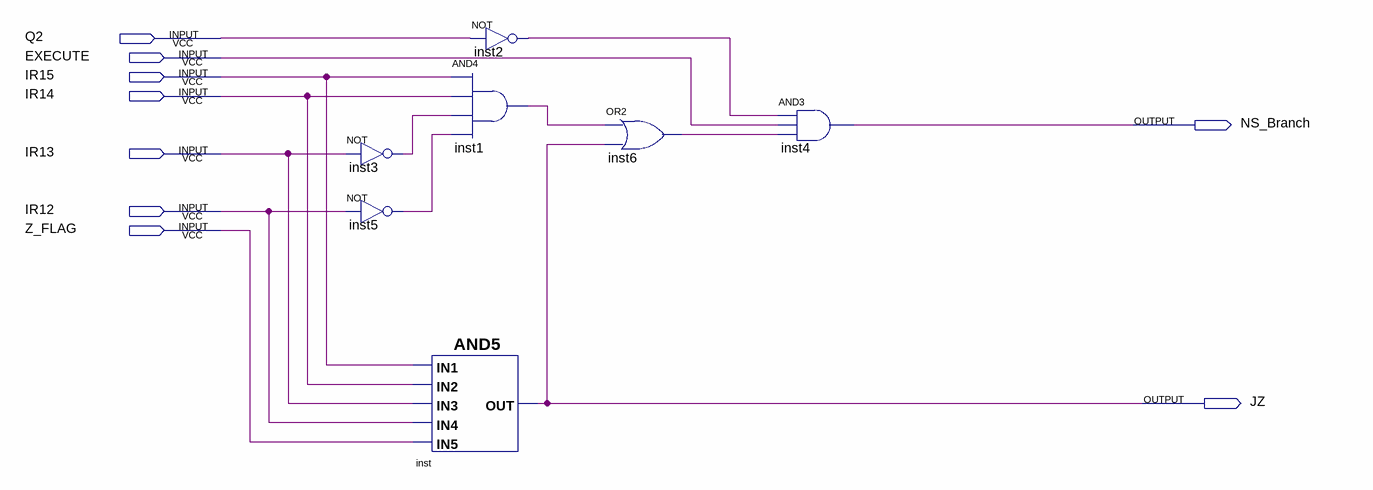
[diagram p0: schematic sheet]
// Quartus schematic Branch_Logic.bdf as structural Verilog: 7 symbols, 9 pins
module Branch_Logic (
  input  Q2,
  input  EXECUTE,
  input  IR15,
  input  IR14,
  input  IR13,
  input  IR12,
  input  Z_FLAG,
  output NS_Branch,
  output JZ
);

  wire inst1_out, inst2_out, inst3_out, inst5_out, inst6_out;

  not inst3 (inst3_out, IR13);
  not inst5 (inst5_out, IR12);
  not inst2 (inst2_out, Q2);
  and inst1 (inst1_out, IR15, IR14, inst3_out, inst5_out);
  and inst (JZ, IR15, IR14, IR13, IR12, Z_FLAG);
  or inst6 (inst6_out, inst1_out, JZ);
  and inst4 (NS_Branch, inst2_out, EXECUTE, inst6_out);
endmodule
